# EasyEDA schematic Deney2Devresi.json
TITLE: Sheet_1; REV: 1.0; Date: 2025-12-11; Sheet: 1/1; Drawn By: 251805044; Company: Your Company
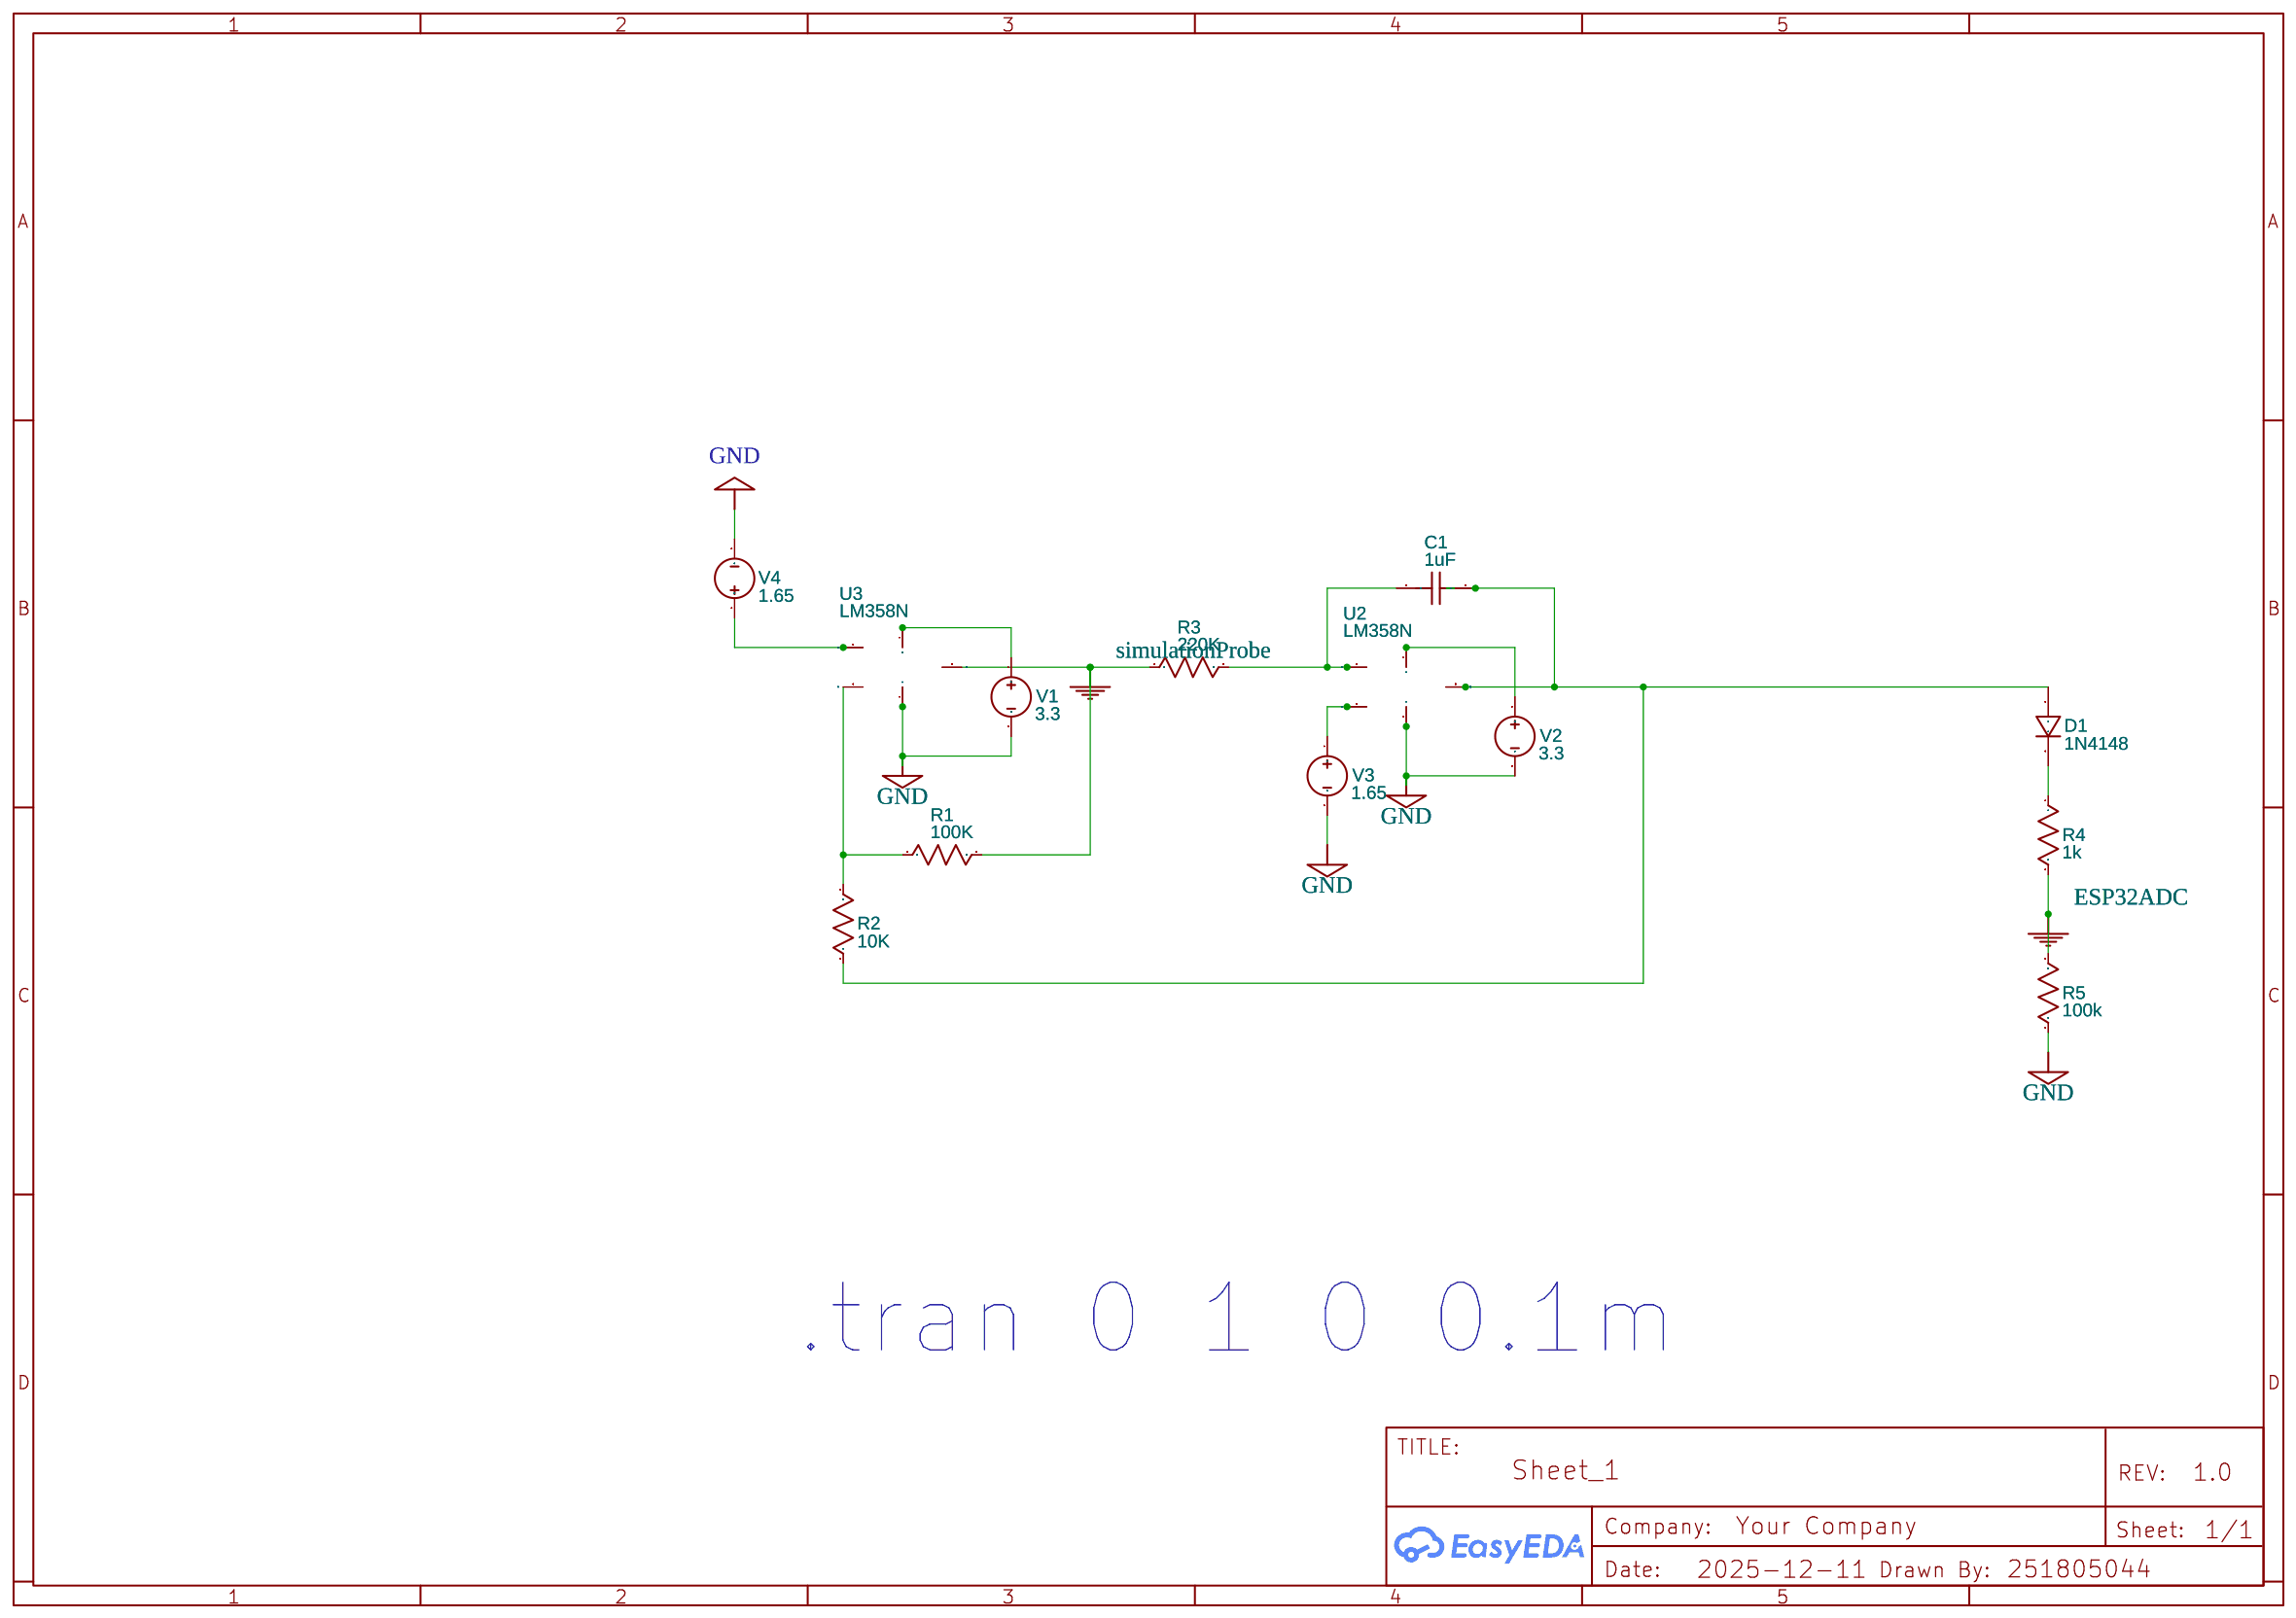
[diagram p0: schematic sheet]

## Parts
C1  1uF  [RAD-0.1]
D1  1N4148  [DO-35]
R1  100K  [AXIAL-0.3]
R2  10K  [AXIAL-0.3]
R3  220K  [AXIAL-0.3]
R4  1k  [AXIAL-0.3]
R5  100k  [AXIAL-0.3]
U2  LM358N  [?]
U3  LM358N  [?]
V1  3.3  [HDR1X2]
V2  3.3  [HDR1X2]
V3  1.65  [HDR1X2]
V4  1.65  [HDR1X2]

## Library data of the parts
C1 = Capacitor_US: Contributor: EasyEDA; Supplier: YUJING; Capacitance: 1u
D1 = 1N4148: Contributor: EasyEDA
R1-R3 R5 = Resistor_US: Resistance: 1k; Contributor: EasyEDA; Supplier: YUJING
R4 = Resistor_US: Contributor: EasyEDA; Supplier: YUJING
U2 U3 = LM358N: Contributor: EasyEDA
V1-V4 = VDC: Contributor: EasyEDA; sim: true

## Nets
GND: R5.1 U2.4(V-) U3.4(V-) V1.2 V2.2 V3.2 V4.2
ESP32ADC: R4.2 R5.2
simulationProbe: R1.2 R3.1 U3.6(OUT)
Net-(C1-1): C1.1 D1.1(A) R2.1 U2.6(OUT)
Net-(C1-2): C1.2 R3.2 U2.2(IN-)
Net-(D1-2): D1.2(K) R4.1
Net-(R1-1): R1.1 R2.2 U3.3(IN+)
Net-(U2-3): U2.3(IN+) V3.1
Net-(U2-7): U2.7(V+) V2.1
Net-(U3-2): U3.2(IN-) V4.1
Net-(U3-7): U3.7(V+) V1.1

## Notes on the sheet
- .tran 0 1 0 0.1m
